# Altium project VENTUNOQ.PrjPcb (part 4 of 18)

## Sheet MODULE_SAIL.SchDoc: MODULE SAIL
size A3; Author: Silvio Navaretti; CompanyName: ARDUINO; DrawnBy: Silvio Navaretti; Engineer: Silvio Navaretti; Organization: ARDUINO; SheetNumber: 4; SheetTotal: 51; RevAuthor: Silvio Navaretti
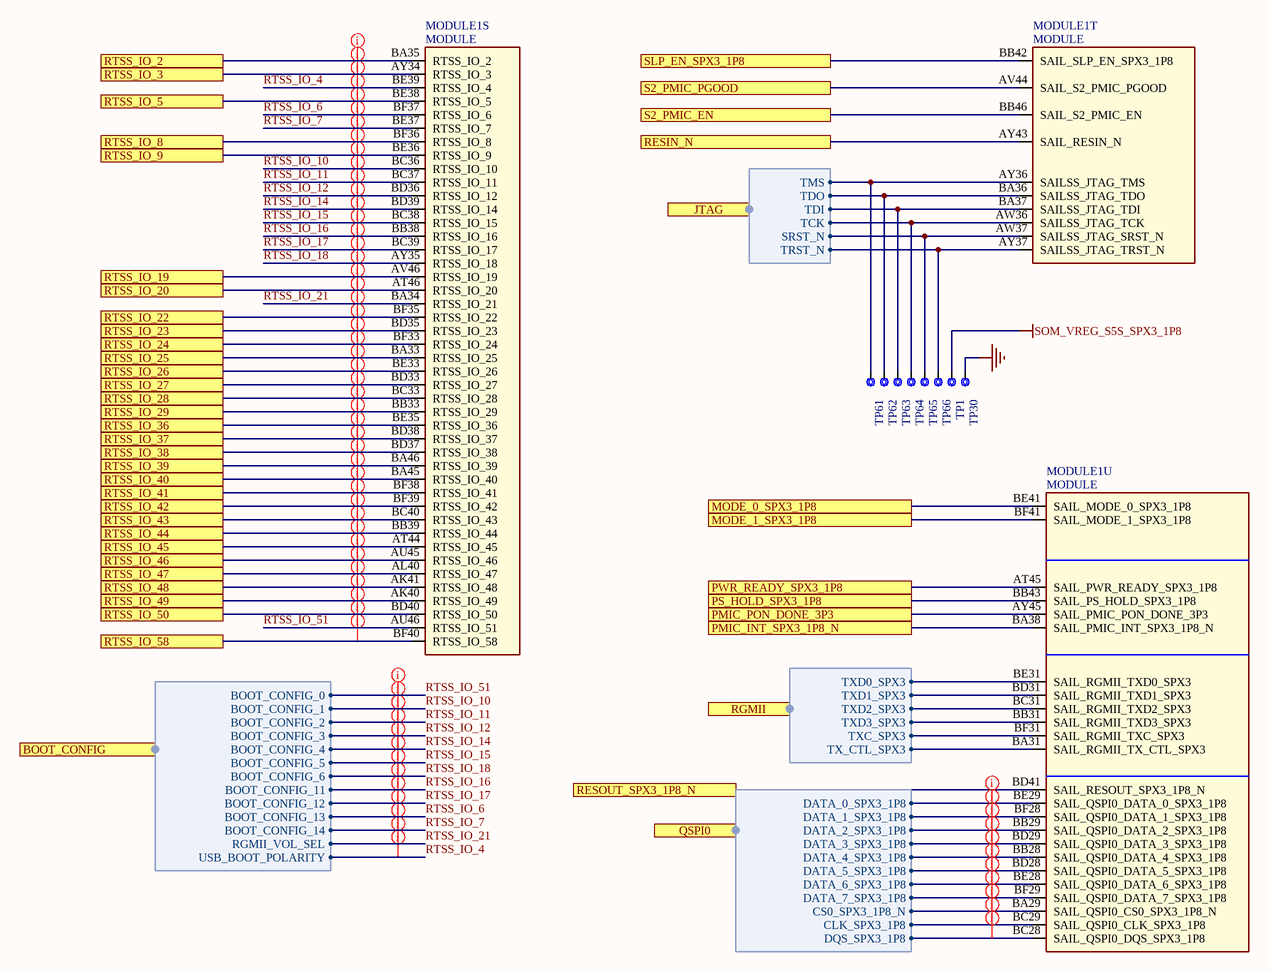
[diagram p5: MODULE_SAIL.SchDoc]

### Parts
MODULE1  MODULE  [MODULE]  (parts S,T,U of 22)
TP1  Test point 1.00mm  [TP-1.00MM]  (value not drawn)  (no BOM)
TP30  Test point 1.00mm  [TP-1.00MM]  (value not drawn)  (no BOM)
TP61  Test point 1.00mm  [TP-1.00MM]  (value not drawn)  (no BOM)
TP62  Test point 1.00mm  [TP-1.00MM]  (value not drawn)  (no BOM)
TP63  Test point 1.00mm  [TP-1.00MM]  (value not drawn)  (no BOM)
TP64  Test point 1.00mm  [TP-1.00MM]  (value not drawn)  (no BOM)
TP65  Test point 1.00mm  [TP-1.00MM]  (value not drawn)  (no BOM)
TP66  Test point 1.00mm  [TP-1.00MM]  (value not drawn)  (no BOM)

### Ports
BOOT_CONFIG (harness SOM_SAIL_BOOT_CONFIG), JTAG (harness SOM_SAIL_JTAG), MODE_0_SPX3_1P8, MODE_1_SPX3_1P8, PMIC_INT_SPX3_1P8_N, PMIC_PON_DONE_3P3, PS_HOLD_SPX3_1P8, PWR_READY_SPX3_1P8, QSPI0 (harness SOM_SAIL_QSPI0), RESIN_N, RESOUT_SPX3_1P8_N, RGMII (harness SOM_SAIL_RGMII), RTSS_IO_2, RTSS_IO_3, RTSS_IO_5, RTSS_IO_8, RTSS_IO_9, RTSS_IO_19, RTSS_IO_20, RTSS_IO_22, RTSS_IO_23, RTSS_IO_24, RTSS_IO_25, RTSS_IO_26, RTSS_IO_27, RTSS_IO_28, RTSS_IO_29, RTSS_IO_36, RTSS_IO_37, RTSS_IO_38, RTSS_IO_39, RTSS_IO_40, RTSS_IO_41, RTSS_IO_42, RTSS_IO_43, RTSS_IO_44, RTSS_IO_45, RTSS_IO_46, RTSS_IO_47, RTSS_IO_48, RTSS_IO_49, RTSS_IO_50, RTSS_IO_58, S2_PMIC_EN, S2_PMIC_PGOOD, SLP_EN_SPX3_1P8

### Harnesses
SOM_SAIL_JTAG: TMS, TDO, TDI, TCK, SRST_N, TRST_N
SOM_SAIL_RGMII: TXD0_SPX3, TXD1_SPX3, TXD2_SPX3, TXD3_SPX3, TXC_SPX3, TX_CTL_SPX3
SOM_SAIL_QSPI0: DATA_0_SPX3_1P8, DATA_1_SPX3_1P8, DATA_2_SPX3_1P8, DATA_3_SPX3_1P8, DATA_4_SPX3_1P8, DATA_5_SPX3_1P8, DATA_6_SPX3_1P8, DATA_7_SPX3_1P8, CS0_SPX3_1P8_N, CLK_SPX3_1P8, DQS_SPX3_1P8
SOM_SAIL_BOOT_CONFIG: BOOT_CONFIG_0, BOOT_CONFIG_1, BOOT_CONFIG_2, BOOT_CONFIG_3, BOOT_CONFIG_4, BOOT_CONFIG_5, BOOT_CONFIG_6, BOOT_CONFIG_11, BOOT_CONFIG_12, BOOT_CONFIG_13, BOOT_CONFIG_14, RGMII_VOL_SEL, USB_BOOT_POLARITY

### Nets
GND: TP30.X
SOM_VREG_S5S_SPX3_1P8: TP1.X
RTSS_IO_4: MODULE1.BE39(RTSS_IO_4) ; port BOOT_CONFIG.USB_BOOT_POLARITY
RTSS_IO_6: MODULE1.BF37(RTSS_IO_6) ; port BOOT_CONFIG.BOOT_CONFIG_13
RTSS_IO_7: MODULE1.BE37(RTSS_IO_7) ; port BOOT_CONFIG.BOOT_CONFIG_14
RTSS_IO_10: MODULE1.BC36(RTSS_IO_10) ; port BOOT_CONFIG.BOOT_CONFIG_1
RTSS_IO_11: MODULE1.BC37(RTSS_IO_11) ; port BOOT_CONFIG.BOOT_CONFIG_2
RTSS_IO_12: MODULE1.BD36(RTSS_IO_12) ; port BOOT_CONFIG.BOOT_CONFIG_3
RTSS_IO_14: MODULE1.BD39(RTSS_IO_14) ; port BOOT_CONFIG.BOOT_CONFIG_4
RTSS_IO_15: MODULE1.BC38(RTSS_IO_15) ; port BOOT_CONFIG.BOOT_CONFIG_5
RTSS_IO_16: MODULE1.BB38(RTSS_IO_16) ; port BOOT_CONFIG.BOOT_CONFIG_11
RTSS_IO_17: MODULE1.BC39(RTSS_IO_17) ; port BOOT_CONFIG.BOOT_CONFIG_12
RTSS_IO_18: MODULE1.AY35(RTSS_IO_18) ; port BOOT_CONFIG.BOOT_CONFIG_6
RTSS_IO_21: MODULE1.BA34(RTSS_IO_21) ; port BOOT_CONFIG.RGMII_VOL_SEL
RTSS_IO_51: MODULE1.AU46(RTSS_IO_51) ; port BOOT_CONFIG.BOOT_CONFIG_0
RTSS_IO_58_FORCE_USB_BOOT_SPX3_1P8: MODULE1.BF40(RTSS_IO_58) ; port RTSS_IO_58
RTSS_RESIN_N: MODULE1.AY43(SAIL_RESIN_N) ; port RESIN_N
SAIL_JTAG.SRST_N: MODULE1.AW37(SAILSS_JTAG_SRST_N) TP65.X ; port JTAG.SRST_N
SAIL_JTAG.TCK: MODULE1.AW36(SAILSS_JTAG_TCK) TP64.X ; port JTAG.TCK
SAIL_JTAG.TDI: MODULE1.BA37(SAILSS_JTAG_TDI) TP63.X ; port JTAG.TDI
SAIL_JTAG.TDO: MODULE1.BA36(SAILSS_JTAG_TDO) TP62.X ; port JTAG.TDO
SAIL_JTAG.TMS: MODULE1.AY36(SAILSS_JTAG_TMS) TP61.X ; port JTAG.TMS
SAIL_JTAG.TRST_N: MODULE1.AY37(SAILSS_JTAG_TRST_N) TP66.X ; port JTAG.TRST_N
NetMODULE1_AK40: MODULE1.AK40(RTSS_IO_49) ; port RTSS_IO_49
NetMODULE1_AK41: MODULE1.AK41(RTSS_IO_48) ; port RTSS_IO_48
NetMODULE1_AL40: MODULE1.AL40(RTSS_IO_47) ; port RTSS_IO_47
NetMODULE1_AT44: MODULE1.AT44(RTSS_IO_45) ; port RTSS_IO_45
NetMODULE1_AT45: MODULE1.AT45(SAIL_PWR_READY_SPX3_1P8) ; port PWR_READY_SPX3_1P8
NetMODULE1_AT46: MODULE1.AT46(RTSS_IO_20) ; port RTSS_IO_20
NetMODULE1_AU45: MODULE1.AU45(RTSS_IO_46) ; port RTSS_IO_46
NetMODULE1_AV44: MODULE1.AV44(SAIL_S2_PMIC_PGOOD) ; port S2_PMIC_PGOOD
NetMODULE1_AV46: MODULE1.AV46(RTSS_IO_19) ; port RTSS_IO_19
NetMODULE1_AY34: MODULE1.AY34(RTSS_IO_3) ; port RTSS_IO_3
NetMODULE1_AY45: MODULE1.AY45(SAIL_PMIC_PON_DONE_3P3) ; port PMIC_PON_DONE_3P3
NetMODULE1_BA29: MODULE1.BA29(SAIL_QSPI0_CS0_SPX3_1P8_N) ; port QSPI0.CS0_SPX3_1P8_N
NetMODULE1_BA31: MODULE1.BA31(SAIL_RGMII_TX_CTL_SPX3) ; port RGMII.TX_CTL_SPX3
NetMODULE1_BA33: MODULE1.BA33(RTSS_IO_25) ; port RTSS_IO_25
NetMODULE1_BA35: MODULE1.BA35(RTSS_IO_2) ; port RTSS_IO_2
NetMODULE1_BA38: MODULE1.BA38(SAIL_PMIC_INT_SPX3_1P8_N) ; port PMIC_INT_SPX3_1P8_N
NetMODULE1_BA45: MODULE1.BA45(RTSS_IO_40) ; port RTSS_IO_40
NetMODULE1_BA46: MODULE1.BA46(RTSS_IO_39) ; port RTSS_IO_39
NetMODULE1_BB28: MODULE1.BB28(SAIL_QSPI0_DATA_4_SPX3_1P8) ; port QSPI0.DATA_4_SPX3_1P8
NetMODULE1_BB29: MODULE1.BB29(SAIL_QSPI0_DATA_2_SPX3_1P8) ; port QSPI0.DATA_2_SPX3_1P8
NetMODULE1_BB31: MODULE1.BB31(SAIL_RGMII_TXD3_SPX3) ; port RGMII.TXD3_SPX3
NetMODULE1_BB33: MODULE1.BB33(RTSS_IO_29) ; port RTSS_IO_29
NetMODULE1_BB39: MODULE1.BB39(RTSS_IO_44) ; port RTSS_IO_44
NetMODULE1_BB42: MODULE1.BB42(SAIL_SLP_EN_SPX3_1P8) ; port SLP_EN_SPX3_1P8
NetMODULE1_BB43: MODULE1.BB43(SAIL_PS_HOLD_SPX3_1P8) ; port PS_HOLD_SPX3_1P8
NetMODULE1_BB46: MODULE1.BB46(SAIL_S2_PMIC_EN) ; port S2_PMIC_EN
NetMODULE1_BC28: MODULE1.BC28(SAIL_QSPI0_DQS_SPX3_1P8) ; port QSPI0.DQS_SPX3_1P8
NetMODULE1_BC29: MODULE1.BC29(SAIL_QSPI0_CLK_SPX3_1P8) ; port QSPI0.CLK_SPX3_1P8
NetMODULE1_BC31: MODULE1.BC31(SAIL_RGMII_TXD2_SPX3) ; port RGMII.TXD2_SPX3
NetMODULE1_BC33: MODULE1.BC33(RTSS_IO_28) ; port RTSS_IO_28
NetMODULE1_BC40: MODULE1.BC40(RTSS_IO_43) ; port RTSS_IO_43
NetMODULE1_BD28: MODULE1.BD28(SAIL_QSPI0_DATA_5_SPX3_1P8) ; port QSPI0.DATA_5_SPX3_1P8
NetMODULE1_BD29: MODULE1.BD29(SAIL_QSPI0_DATA_3_SPX3_1P8) ; port QSPI0.DATA_3_SPX3_1P8
NetMODULE1_BD31: MODULE1.BD31(SAIL_RGMII_TXD1_SPX3) ; port RGMII.TXD1_SPX3
NetMODULE1_BD33: MODULE1.BD33(RTSS_IO_27) ; port RTSS_IO_27
NetMODULE1_BD35: MODULE1.BD35(RTSS_IO_23) ; port RTSS_IO_23
NetMODULE1_BD37: MODULE1.BD37(RTSS_IO_38) ; port RTSS_IO_38
NetMODULE1_BD38: MODULE1.BD38(RTSS_IO_37) ; port RTSS_IO_37
NetMODULE1_BD40: MODULE1.BD40(RTSS_IO_50) ; port RTSS_IO_50
NetMODULE1_BD41: MODULE1.BD41(SAIL_RESOUT_SPX3_1P8_N) ; port RESOUT_SPX3_1P8_N
NetMODULE1_BE28: MODULE1.BE28(SAIL_QSPI0_DATA_6_SPX3_1P8) ; port QSPI0.DATA_6_SPX3_1P8
NetMODULE1_BE29: MODULE1.BE29(SAIL_QSPI0_DATA_0_SPX3_1P8) ; port QSPI0.DATA_0_SPX3_1P8
NetMODULE1_BE31: MODULE1.BE31(SAIL_RGMII_TXD0_SPX3) ; port RGMII.TXD0_SPX3
NetMODULE1_BE33: MODULE1.BE33(RTSS_IO_26) ; port RTSS_IO_26
NetMODULE1_BE35: MODULE1.BE35(RTSS_IO_36) ; port RTSS_IO_36
NetMODULE1_BE36: MODULE1.BE36(RTSS_IO_9) ; port RTSS_IO_9
NetMODULE1_BE38: MODULE1.BE38(RTSS_IO_5) ; port RTSS_IO_5
NetMODULE1_BE41: MODULE1.BE41(SAIL_MODE_0_SPX3_1P8) ; port MODE_0_SPX3_1P8
NetMODULE1_BF28: MODULE1.BF28(SAIL_QSPI0_DATA_1_SPX3_1P8) ; port QSPI0.DATA_1_SPX3_1P8
NetMODULE1_BF29: MODULE1.BF29(SAIL_QSPI0_DATA_7_SPX3_1P8) ; port QSPI0.DATA_7_SPX3_1P8
NetMODULE1_BF31: MODULE1.BF31(SAIL_RGMII_TXC_SPX3) ; port RGMII.TXC_SPX3
NetMODULE1_BF33: MODULE1.BF33(RTSS_IO_24) ; port RTSS_IO_24
NetMODULE1_BF35: MODULE1.BF35(RTSS_IO_22) ; port RTSS_IO_22
NetMODULE1_BF36: MODULE1.BF36(RTSS_IO_8) ; port RTSS_IO_8
NetMODULE1_BF38: MODULE1.BF38(RTSS_IO_41) ; port RTSS_IO_41
NetMODULE1_BF39: MODULE1.BF39(RTSS_IO_42) ; port RTSS_IO_42
NetMODULE1_BF41: MODULE1.BF41(SAIL_MODE_1_SPX3_1P8) ; port MODE_1_SPX3_1P8

### Layout directives
net class NET_SOM_SAIL_BOOT: RTSS_IO_4, RTSS_IO_6, RTSS_IO_7, RTSS_IO_10, RTSS_IO_11, RTSS_IO_12, RTSS_IO_14, RTSS_IO_15, RTSS_IO_16, RTSS_IO_17, RTSS_IO_18, RTSS_IO_21, RTSS_IO_51
net class NET_SOM_SAIL_IO: NetMODULE1_AK40, NetMODULE1_AK41, NetMODULE1_AL40, NetMODULE1_AT44, NetMODULE1_AT46, NetMODULE1_AU45, NetMODULE1_AV46, NetMODULE1_AY34, NetMODULE1_BA33, NetMODULE1_BA35, NetMODULE1_BA45, NetMODULE1_BA46, NetMODULE1_BB33, NetMODULE1_BB39, NetMODULE1_BC33, NetMODULE1_BC40, NetMODULE1_BD33, NetMODULE1_BD35, NetMODULE1_BD37, NetMODULE1_BD38, NetMODULE1_BD40, NetMODULE1_BE33, NetMODULE1_BE35, NetMODULE1_BE36, NetMODULE1_BE38, NetMODULE1_BF33, NetMODULE1_BF35, NetMODULE1_BF36, NetMODULE1_BF38, NetMODULE1_BF39, RTSS_IO_4, RTSS_IO_6, RTSS_IO_7, RTSS_IO_10, RTSS_IO_11, RTSS_IO_12, RTSS_IO_14, RTSS_IO_15, RTSS_IO_16, RTSS_IO_17, RTSS_IO_18, RTSS_IO_21, RTSS_IO_51, RTSS_IO_58_FORCE_USB_BOOT_SPX3_1P8
net class NET_SOM_SAIL_QSPI0: NetMODULE1_BA29, NetMODULE1_BB28, NetMODULE1_BB29, NetMODULE1_BC28, NetMODULE1_BC29, NetMODULE1_BD28, NetMODULE1_BD29, NetMODULE1_BE28, NetMODULE1_BE29, NetMODULE1_BF28, NetMODULE1_BF29

### Notes on the sheet
- Title:
- ID:
- Date:
- Time:
- Version:
- Sheet
- of
- RevAuthor:
- Reference Designs ARE PROVIDED "AS IS" AND "WITH ALL FAULTS. Arduino SA DISCLAIMS ALL OTHER WARRANTIES, EXPRESS OR IMPLIED, REGARDING PRODUCTS, INCLUDING BUT NOT LIMITED TO, ANY IMPLIED WARRANTIES OF MERCHANTABILITY OR FITNESS FOR A PARTICULAR PURPOSE.
  Arduino SA may make changes to specifications and product descriptions at any time, without notice. The Customer must not rely on the absence or characteristics of any features or instructions marked "reserved" or "undefined".
  Arduino SA reserves these for future definition and shall have no responsibility whatsoever for conflicts or incompatibilities arising from future changes to them. The product information on the Web Site or Materials is subject to change without notice.
  Do not finalize a design with this info. ARDUINO and other Arduino brands and logos and Trademarks of Arduino SA. All Arduino SA Trademarks cannot be used without owner's formal permission.
- File:
- Author:

### Library data of the parts
MODULE1 = M0029-A.19: MODULE BGA 1883 balls 57.5x57.5mm; Manufacturer: Qualcomm; Code Arduino: M0029; Part Number: MODULE BGA; Pin Count: 1883
TP1 TP30 TP61-TP66 = UT0013-A.6: Part Number: This is not a component; Design Item ID: CMP-018-0005-A.3; Source: ut.SchLib; Manufacturer: This is not a component; Code Arduino: This is not a component; Pin Count: 1

## Sheet MODULE_MD.SchDoc: MODULE MAIN DOMAIN
size A3; Author: Silvio Navaretti; CompanyName: ARDUINO; DrawnBy: Silvio Navaretti; Engineer: Silvio Navaretti; Organization: ARDUINO; SheetNumber: 3; SheetTotal: 51; RevAuthor: Silvio Navaretti
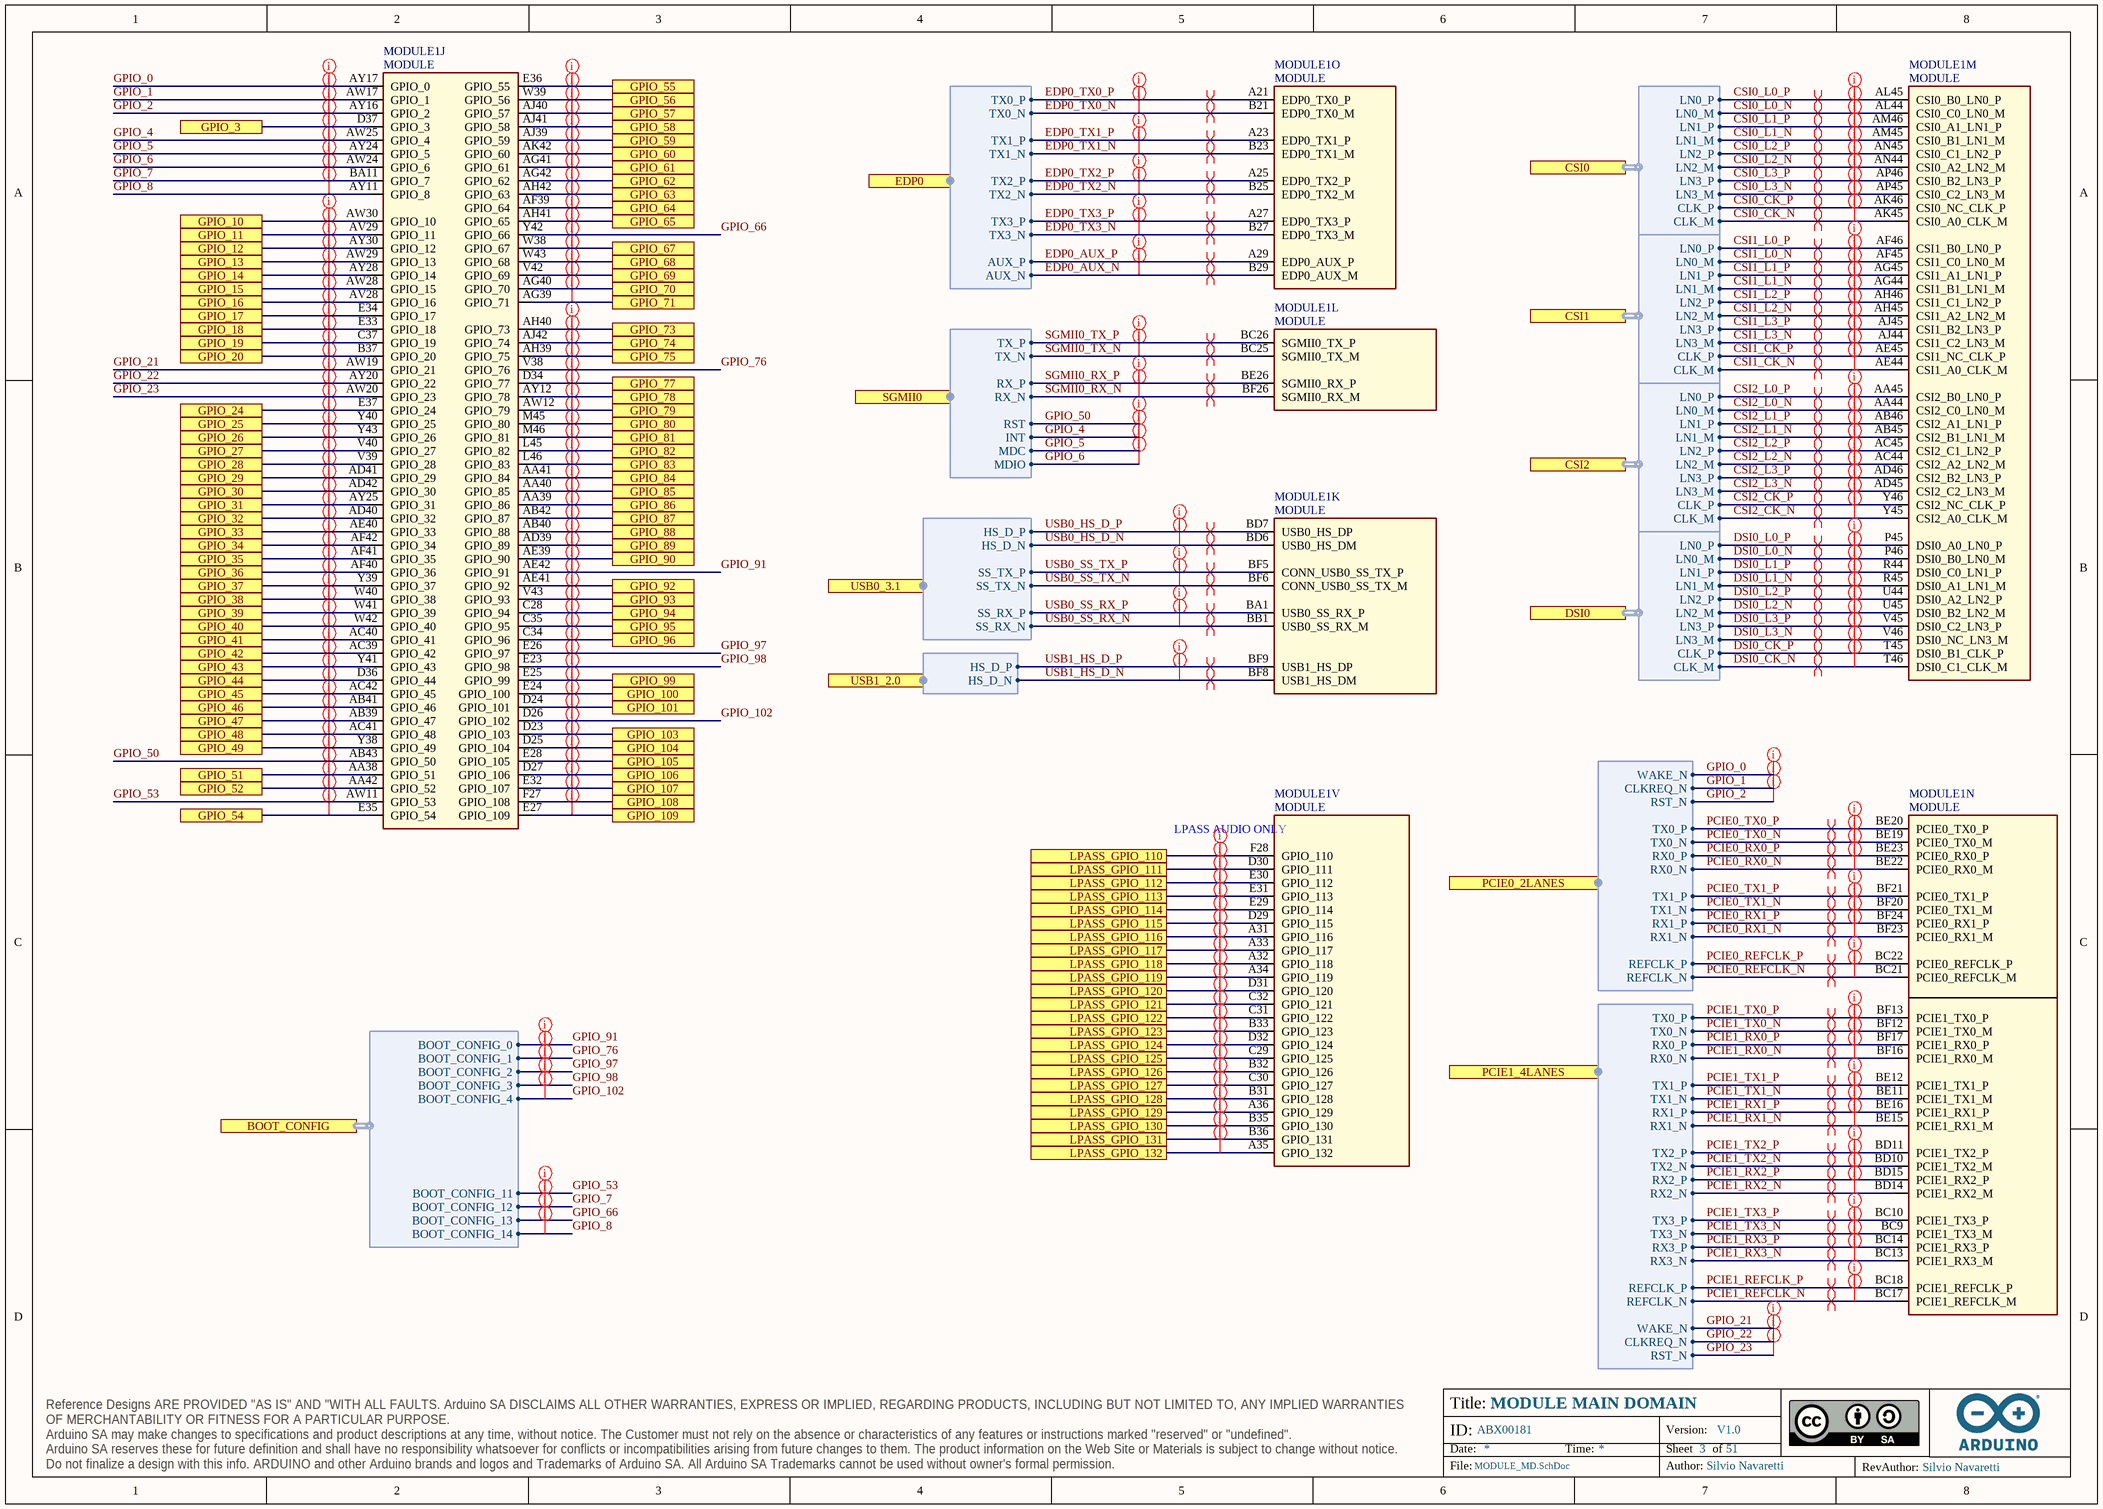
[diagram p6: MODULE_MD.SchDoc]

### Parts
MODULE1  MODULE  [MODULE]  (parts J,K,L,M,N,O,V of 22)

### Ports
BOOT_CONFIG (harness SOM_MD_BOOT_CONFIG), CSI0 (harness MIPI_4LANES), CSI1 (harness MIPI_4LANES), CSI2 (harness MIPI_4LANES), DSI0 (harness MIPI_4LANES), EDP0 (harness SOM_MD_EDP0), GPIO_3, GPIO_10, GPIO_11, GPIO_12, GPIO_13, GPIO_14, GPIO_15, GPIO_16, GPIO_17, GPIO_18, GPIO_19, GPIO_20, GPIO_24, GPIO_25, GPIO_26, GPIO_27, GPIO_28, GPIO_29, GPIO_30, GPIO_31, GPIO_32, GPIO_33, GPIO_34, GPIO_35, GPIO_36, GPIO_37, GPIO_38, GPIO_39, GPIO_40, GPIO_41, GPIO_42, GPIO_43, GPIO_44, GPIO_45, GPIO_46, GPIO_47, GPIO_48, GPIO_49, GPIO_51, GPIO_52, GPIO_54, GPIO_55, GPIO_56, GPIO_57, GPIO_58, GPIO_59, GPIO_60, GPIO_61, GPIO_62, GPIO_63, GPIO_64, GPIO_65, GPIO_67, GPIO_68, GPIO_69, GPIO_70, GPIO_71, GPIO_73, GPIO_74, GPIO_75, GPIO_77, GPIO_78, GPIO_79, GPIO_80, GPIO_81, GPIO_82, GPIO_83, GPIO_84, GPIO_85, GPIO_86, GPIO_87, GPIO_88, GPIO_89, GPIO_90, GPIO_92, GPIO_93, GPIO_94, GPIO_95, GPIO_96, GPIO_99, GPIO_100, GPIO_101, GPIO_103, GPIO_104, GPIO_105, GPIO_106, GPIO_107, GPIO_108, GPIO_109, LPASS_GPIO_110, LPASS_GPIO_111, LPASS_GPIO_112, LPASS_GPIO_113, LPASS_GPIO_114, LPASS_GPIO_115, LPASS_GPIO_116, LPASS_GPIO_117, LPASS_GPIO_118, LPASS_GPIO_119, LPASS_GPIO_120, LPASS_GPIO_121, LPASS_GPIO_122, LPASS_GPIO_123, LPASS_GPIO_124, LPASS_GPIO_125, LPASS_GPIO_126, LPASS_GPIO_127, LPASS_GPIO_128, LPASS_GPIO_129, LPASS_GPIO_130, LPASS_GPIO_131, LPASS_GPIO_132, PCIE0_2LANES (harness SOM_MD_PCIE0), PCIE1_4LANES (harness SOM_MD_PCIE1), SGMII0 (harness SOM_MD_SGMII0), USB0_3.1 (harness SOM_MD_USB0), USB1_2.0 (harness SOM_MD_USB1)

### Harnesses
MIPI_4LANES: LN3_M, LN2_M, LN2_P, LN0_M, LN0_P, CLK_M, CLK_P, LN1_M, LN1_P, LN3_P
SOM_MD_SGMII0: RX_P, RX_N, TX_P, TX_N, RST, MDC, INT, MDIO
SOM_MD_EDP0: TX0_P, TX1_P, TX2_P, TX3_P, AUX_P, TX0_N, TX1_N, TX2_N, TX3_N, AUX_N
SOM_MD_USB0: SS_TX_N, SS_TX_P, HS_D_P, HS_D_N, SS_RX_P, SS_RX_N
SOM_MD_USB1: HS_D_P, HS_D_N
SOM_MD_PCIE0: RX0_N, RX0_P, TX0_P, TX0_N, RX1_N, RX1_P, TX1_P, TX1_N, REFCLK_N, REFCLK_P, WAKE_N, CLKREQ_N, RST_N
SOM_MD_PCIE1: RX0_N, RX0_P, TX0_P, TX0_N, RX1_N, RX1_P, TX1_P, TX1_N, REFCLK_N, REFCLK_P, RX2_N, RX2_P, TX2_P, TX2_N, RX3_N, RX3_P, TX3_P, TX3_N, WAKE_N, CLKREQ_N, RST_N
SOM_MD_BOOT_CONFIG: BOOT_CONFIG_0, BOOT_CONFIG_1, BOOT_CONFIG_2, BOOT_CONFIG_3, BOOT_CONFIG_4, BOOT_CONFIG_11, BOOT_CONFIG_12, BOOT_CONFIG_13, BOOT_CONFIG_14

### Nets
CSI0_CK_N: MODULE1.AK45(CSI0_A0_CLK_M) ; port CSI0.CLK_M
CSI0_CK_P: MODULE1.AK46(CSI0_NC_CLK_P) ; port CSI0.CLK_P
CSI0_L0_N: MODULE1.AL44(CSI0_C0_LN0_M) ; port CSI0.LN0_M
CSI0_L0_P: MODULE1.AL45(CSI0_B0_LN0_P) ; port CSI0.LN0_P
CSI0_L1_N: MODULE1.AM45(CSI0_B1_LN1_M) ; port CSI0.LN1_M
CSI0_L1_P: MODULE1.AM46(CSI0_A1_LN1_P) ; port CSI0.LN1_P
CSI0_L2_N: MODULE1.AN44(CSI0_A2_LN2_M) ; port CSI0.LN2_M
CSI0_L2_P: MODULE1.AN45(CSI0_C1_LN2_P) ; port CSI0.LN2_P
CSI0_L3_N: MODULE1.AP45(CSI0_C2_LN3_M) ; port CSI0.LN3_M
CSI0_L3_P: MODULE1.AP46(CSI0_B2_LN3_P) ; port CSI0.LN3_P
CSI1_CK_N: MODULE1.AE44(CSI1_A0_CLK_M) ; port CSI1.CLK_M
CSI1_CK_P: MODULE1.AE45(CSI1_NC_CLK_P) ; port CSI1.CLK_P
CSI1_L0_N: MODULE1.AF45(CSI1_C0_LN0_M) ; port CSI1.LN0_M
CSI1_L0_P: MODULE1.AF46(CSI1_B0_LN0_P) ; port CSI1.LN0_P
CSI1_L1_N: MODULE1.AG44(CSI1_B1_LN1_M) ; port CSI1.LN1_M
CSI1_L1_P: MODULE1.AG45(CSI1_A1_LN1_P) ; port CSI1.LN1_P
CSI1_L2_N: MODULE1.AH45(CSI1_A2_LN2_M) ; port CSI1.LN2_M
CSI1_L2_P: MODULE1.AH46(CSI1_C1_LN2_P) ; port CSI1.LN2_P
CSI1_L3_N: MODULE1.AJ44(CSI1_C2_LN3_M) ; port CSI1.LN3_M
CSI1_L3_P: MODULE1.AJ45(CSI1_B2_LN3_P) ; port CSI1.LN3_P
CSI2_CK_N: MODULE1.Y45(CSI2_A0_CLK_M) ; port CSI2.CLK_M
CSI2_CK_P: MODULE1.Y46(CSI2_NC_CLK_P) ; port CSI2.CLK_P
CSI2_L0_N: MODULE1.AA44(CSI2_C0_LN0_M) ; port CSI2.LN0_M
CSI2_L0_P: MODULE1.AA45(CSI2_B0_LN0_P) ; port CSI2.LN0_P
CSI2_L1_N: MODULE1.AB45(CSI2_B1_LN1_M) ; port CSI2.LN1_M
CSI2_L1_P: MODULE1.AB46(CSI2_A1_LN1_P) ; port CSI2.LN1_P
CSI2_L2_N: MODULE1.AC44(CSI2_A2_LN2_M) ; port CSI2.LN2_M
CSI2_L2_P: MODULE1.AC45(CSI2_C1_LN2_P) ; port CSI2.LN2_P
CSI2_L3_N: MODULE1.AD45(CSI2_C2_LN3_M) ; port CSI2.LN3_M
CSI2_L3_P: MODULE1.AD46(CSI2_B2_LN3_P) ; port CSI2.LN3_P
CTS_1V8: MODULE1.AA41(GPIO_84) ; port GPIO_84
DSI0_CK_N: MODULE1.T46(DSI0_C1_CLK_M) ; port DSI0.CLK_M
DSI0_CK_P: MODULE1.T45(DSI0_B1_CLK_P) ; port DSI0.CLK_P
DSI0_L0_N: MODULE1.P46(DSI0_B0_LN0_M) ; port DSI0.LN0_M
DSI0_L0_P: MODULE1.P45(DSI0_A0_LN0_P) ; port DSI0.LN0_P
DSI0_L1_N: MODULE1.R45(DSI0_A1_LN1_M) ; port DSI0.LN1_M
DSI0_L1_P: MODULE1.R44(DSI0_C0_LN1_P) ; port DSI0.LN1_P
DSI0_L2_N: MODULE1.U45(DSI0_B2_LN2_M) ; port DSI0.LN2_M
DSI0_L2_P: MODULE1.U44(DSI0_A2_LN2_P) ; port DSI0.LN2_P
DSI0_L3_N: MODULE1.V46(DSI0_NC_LN3_M) ; port DSI0.LN3_M
DSI0_L3_P: MODULE1.V45(DSI0_C2_LN3_P) ; port DSI0.LN3_P
EDP0_AUX_N: MODULE1.B29(EDP0_AUX_M) ; port EDP0.AUX_N
EDP0_AUX_P: MODULE1.A29(EDP0_AUX_P) ; port EDP0.AUX_P
EDP0_TX0_N: MODULE1.B21(EDP0_TX0_M) ; port EDP0.TX0_N
EDP0_TX0_P: MODULE1.A21(EDP0_TX0_P) ; port EDP0.TX0_P
EDP0_TX1_N: MODULE1.B23(EDP0_TX1_M) ; port EDP0.TX1_N
EDP0_TX1_P: MODULE1.A23(EDP0_TX1_P) ; port EDP0.TX1_P
EDP0_TX2_N: MODULE1.B25(EDP0_TX2_M) ; port EDP0.TX2_N
EDP0_TX2_P: MODULE1.A25(EDP0_TX2_P) ; port EDP0.TX2_P
EDP0_TX3_N: MODULE1.B27(EDP0_TX3_M) ; port EDP0.TX3_N
EDP0_TX3_P: MODULE1.A27(EDP0_TX3_P) ; port EDP0.TX3_P
GPIO_0: MODULE1.AY17(GPIO_0) ; port PCIE0_2LANES.WAKE_N
GPIO_1: MODULE1.AW17(GPIO_1) ; port PCIE0_2LANES.CLKREQ_N  [project net CLKREQ_N_1V8]
GPIO_2: MODULE1.AY16(GPIO_2) ; port PCIE0_2LANES.RST_N
GPIO_4: MODULE1.AW25(GPIO_4) ; port SGMII0.INT
GPIO_5: MODULE1.AY24(GPIO_5) ; port SGMII0.MDC
GPIO_6: MODULE1.AW24(GPIO_6) ; port SGMII0.MDIO
GPIO_7: MODULE1.BA11(GPIO_7) ; port BOOT_CONFIG.BOOT_CONFIG_12
GPIO_8: MODULE1.AY11(GPIO_8) ; port BOOT_CONFIG.BOOT_CONFIG_14
GPIO_21: MODULE1.AW19(GPIO_21) ; port PCIE1_4LANES.WAKE_N
GPIO_22: MODULE1.AY20(GPIO_22) ; port PCIE1_4LANES.CLKREQ_N
GPIO_23: MODULE1.AW20(GPIO_23) ; port PCIE1_4LANES.RST_N
GPIO_50: MODULE1.AB43(GPIO_50) ; port SGMII0.RST
GPIO_53: MODULE1.AW11(GPIO_53) ; port BOOT_CONFIG.BOOT_CONFIG_11
GPIO_66: MODULE1.Y42(GPIO_66) ; port BOOT_CONFIG.BOOT_CONFIG_13
GPIO_76: MODULE1.V38(GPIO_76) ; port BOOT_CONFIG.BOOT_CONFIG_1
GPIO_91: MODULE1.AE42(GPIO_91) ; port BOOT_CONFIG.BOOT_CONFIG_0
GPIO_97: MODULE1.E26(GPIO_97) ; port BOOT_CONFIG.BOOT_CONFIG_2
GPIO_98: MODULE1.E23(GPIO_98) ; port BOOT_CONFIG.BOOT_CONFIG_3
GPIO_102: MODULE1.D26(GPIO_102) ; port BOOT_CONFIG.BOOT_CONFIG_4
I2S_DATA0: MODULE1.A32(GPIO_118) ; port LPASS_GPIO_118
I2S_DATA1: MODULE1.A34(GPIO_119) ; port LPASS_GPIO_119
I2S_SCK: MODULE1.A31(GPIO_116) ; port LPASS_GPIO_116
I2S_WS: MODULE1.A33(GPIO_117) ; port LPASS_GPIO_117
MD_CCI_I2C0.SCL: MODULE1.AJ41(GPIO_58) ; port GPIO_58
MD_CCI_I2C0.SDA: MODULE1.AJ40(GPIO_57) ; port GPIO_57
MD_CCI_I2C2.SCL: MODULE1.AK42(GPIO_60) ; port GPIO_60
MD_CCI_I2C2.SDA: MODULE1.AJ39(GPIO_59) ; port GPIO_59
MD_CCI_I2C3.SCL: MODULE1.AD40(GPIO_32) ; port GPIO_32
MD_CCI_I2C3.SDA: MODULE1.AY25(GPIO_31) ; port GPIO_31
MD_CCI_I2C4.SCL: MODULE1.AG42(GPIO_62) ; port GPIO_62
MD_CCI_I2C4.SDA: MODULE1.AG41(GPIO_61) ; port GPIO_61
MD_GPIO_3: MODULE1.D37(GPIO_3) ; port GPIO_3
MD_GPIO_10: MODULE1.AW30(GPIO_10) ; port GPIO_10
MD_GPIO_11: MODULE1.AV29(GPIO_11) ; port GPIO_11
MD_GPIO_12: MODULE1.AY30(GPIO_12) ; port GPIO_12
MD_GPIO_13: MODULE1.AW29(GPIO_13) ; port GPIO_13
MD_GPIO_14: MODULE1.AY28(GPIO_14) ; port GPIO_14
MD_GPIO_15: MODULE1.AW28(GPIO_15) ; port GPIO_15
MD_GPIO_16: MODULE1.AV28(GPIO_16) ; port GPIO_16
MD_GPIO_17: MODULE1.E34(GPIO_17) ; port GPIO_17
MD_GPIO_18: MODULE1.E33(GPIO_18) ; port GPIO_18
MD_GPIO_19: MODULE1.C37(GPIO_19) ; port GPIO_19
MD_GPIO_20: MODULE1.B37(GPIO_20) ; port GPIO_20
MD_GPIO_24: MODULE1.E37(GPIO_24) ; port GPIO_24
MD_GPIO_25: MODULE1.Y40(GPIO_25) ; port GPIO_25
MD_GPIO_26: MODULE1.Y43(GPIO_26) ; port GPIO_26
MD_GPIO_27: MODULE1.V40(GPIO_27) ; port GPIO_27
MD_GPIO_28: MODULE1.V39(GPIO_28) ; port GPIO_28
MD_GPIO_29: MODULE1.AD41(GPIO_29) ; port GPIO_29
MD_GPIO_30: MODULE1.AD42(GPIO_30) ; port GPIO_30
MD_GPIO_33: MODULE1.AE40(GPIO_33) ; port GPIO_33
MD_GPIO_34: MODULE1.AF42(GPIO_34) ; port GPIO_34
MD_GPIO_35: MODULE1.AF41(GPIO_35) ; port GPIO_35
MD_GPIO_36: MODULE1.AF40(GPIO_36) ; port GPIO_36
MD_GPIO_37: MODULE1.Y39(GPIO_37) ; port GPIO_37
MD_GPIO_38: MODULE1.W40(GPIO_38) ; port GPIO_38
MD_GPIO_39: MODULE1.W41(GPIO_39) ; port GPIO_39
MD_GPIO_40: MODULE1.W42(GPIO_40) ; port GPIO_40
MD_GPIO_41: MODULE1.AC40(GPIO_41) ; port GPIO_41
MD_GPIO_42: MODULE1.AC39(GPIO_42) ; port GPIO_42
MD_GPIO_43: MODULE1.Y41(GPIO_43) ; port GPIO_43
MD_GPIO_44: MODULE1.D36(GPIO_44) ; port GPIO_44
MD_GPIO_45: MODULE1.AC42(GPIO_45) ; port GPIO_45
MD_GPIO_46: MODULE1.AB41(GPIO_46) ; port GPIO_46
MD_GPIO_47: MODULE1.AB39(GPIO_47) ; port GPIO_47
MD_GPIO_48: MODULE1.AC41(GPIO_48) ; port GPIO_48
MD_GPIO_49: MODULE1.Y38(GPIO_49) ; port GPIO_49
MD_GPIO_51: MODULE1.AA38(GPIO_51) ; port GPIO_51
MD_GPIO_52: MODULE1.AA42(GPIO_52) ; port GPIO_52
MD_GPIO_54: MODULE1.E35(GPIO_54) ; port GPIO_54
MD_GPIO_55: MODULE1.E36(GPIO_55) ; port GPIO_55
MD_GPIO_56: MODULE1.W39(GPIO_56) ; port GPIO_56
MD_GPIO_63: MODULE1.AH42(GPIO_63) ; port GPIO_63
MD_GPIO_64: MODULE1.AF39(GPIO_64) ; port GPIO_64
MD_GPIO_65: MODULE1.AH41(GPIO_65) ; port GPIO_65
MD_GPIO_67: MODULE1.W38(GPIO_67) ; port GPIO_67
MD_GPIO_68: MODULE1.W43(GPIO_68) ; port GPIO_68
MD_GPIO_69: MODULE1.V42(GPIO_69) ; port GPIO_69
MD_GPIO_70: MODULE1.AG40(GPIO_70) ; port GPIO_70
MD_GPIO_71: MODULE1.AG39(GPIO_71) ; port GPIO_71
MD_GPIO_73: MODULE1.AH40(GPIO_73) ; port GPIO_73
MD_GPIO_74: MODULE1.AJ42(GPIO_74) ; port GPIO_74
MD_GPIO_75: MODULE1.AH39(GPIO_75) ; port GPIO_75
MD_GPIO_77: MODULE1.D34(GPIO_77) ; port GPIO_77
MD_GPIO_78: MODULE1.AY12(GPIO_78) ; port GPIO_78
MD_GPIO_79: MODULE1.AW12(GPIO_79) ; port GPIO_79
MD_GPIO_80: MODULE1.M45(GPIO_80) ; port GPIO_80
MD_GPIO_81: MODULE1.M46(GPIO_81) ; port GPIO_81
MD_GPIO_82: MODULE1.L45(GPIO_82) ; port GPIO_82
MD_GPIO_83: MODULE1.L46(GPIO_83) ; port GPIO_83
MD_GPIO_85: MODULE1.AA40(GPIO_85) ; port GPIO_85
MD_GPIO_86: MODULE1.AA39(GPIO_86) ; port GPIO_86
MD_GPIO_87: MODULE1.AB42(GPIO_87) ; port GPIO_87
MD_GPIO_88: MODULE1.AB40(GPIO_88) ; port GPIO_88
MD_GPIO_89: MODULE1.AD39(GPIO_89) ; port GPIO_89
MD_GPIO_90: MODULE1.AE39(GPIO_90) ; port GPIO_90
MD_GPIO_92: MODULE1.AE41(GPIO_92) ; port GPIO_92
MD_GPIO_93: MODULE1.V43(GPIO_93) ; port GPIO_93
MD_GPIO_94: MODULE1.C28(GPIO_94) ; port GPIO_94
MD_GPIO_95: MODULE1.C35(GPIO_95) ; port GPIO_95
MD_GPIO_96: MODULE1.C34(GPIO_96) ; port GPIO_96
MD_GPIO_99: MODULE1.E25(GPIO_99) ; port GPIO_99
MD_GPIO_100: MODULE1.E24(GPIO_100) ; port GPIO_100
MD_GPIO_101: MODULE1.D24(GPIO_101) ; port GPIO_101
MD_GPIO_103: MODULE1.D23(GPIO_103) ; port GPIO_103
MD_GPIO_104: MODULE1.D25(GPIO_104) ; port GPIO_104
MD_GPIO_105: MODULE1.E28(GPIO_105) ; port GPIO_105
MD_GPIO_106: MODULE1.D27(GPIO_106) ; port GPIO_106
MD_GPIO_107: MODULE1.E32(GPIO_107) ; port GPIO_107
MD_GPIO_108: MODULE1.F27(GPIO_108) ; port GPIO_108
MD_GPIO_109: MODULE1.E27(GPIO_109) ; port GPIO_109
MD_LPASS_GPIO_110: MODULE1.F28(GPIO_110) ; port LPASS_GPIO_110
MD_LPASS_GPIO_111: MODULE1.D30(GPIO_111) ; port LPASS_GPIO_111
MD_LPASS_GPIO_112: MODULE1.E30(GPIO_112) ; port LPASS_GPIO_112
MD_LPASS_GPIO_113: MODULE1.E31(GPIO_113) ; port LPASS_GPIO_113
MD_LPASS_GPIO_115: MODULE1.D29(GPIO_115) ; port LPASS_GPIO_115
MD_LPASS_GPIO_120: MODULE1.D31(GPIO_120) ; port LPASS_GPIO_120
MD_LPASS_GPIO_121: MODULE1.C32(GPIO_121) ; port LPASS_GPIO_121
MD_LPASS_GPIO_122: MODULE1.C31(GPIO_122) ; port LPASS_GPIO_122
MD_LPASS_GPIO_123: MODULE1.B33(GPIO_123) ; port LPASS_GPIO_123
MD_LPASS_GPIO_125: MODULE1.C29(GPIO_125) ; port LPASS_GPIO_125
MD_LPASS_GPIO_126: MODULE1.B32(GPIO_126) ; port LPASS_GPIO_126
MD_LPASS_GPIO_127: MODULE1.C30(GPIO_127) ; port LPASS_GPIO_127
MD_LPASS_GPIO_129: MODULE1.A36(GPIO_129) ; port LPASS_GPIO_129
MD_LPASS_GPIO_130: MODULE1.B35(GPIO_130) ; port LPASS_GPIO_130
MD_LPASS_GPIO_131: MODULE1.B36(GPIO_131) ; port LPASS_GPIO_131
MD_LPASS_GPIO_132: MODULE1.A35(GPIO_132) ; port LPASS_GPIO_132
PCIE0_REFCLK_N: MODULE1.BC21(PCIE0_REFCLK_M) ; port PCIE0_2LANES.REFCLK_N  [project net MD_PCIE0_2LANES.REFCLK_N]
PCIE0_REFCLK_P: MODULE1.BC22(PCIE0_REFCLK_P) ; port PCIE0_2LANES.REFCLK_P  [project net MD_PCIE0_2LANES.REFCLK_P]
PCIE0_RX0_N: MODULE1.BE22(PCIE0_RX0_M) ; port PCIE0_2LANES.RX0_N  [project net MD_PCIE0_2LANES.RX0_N]
PCIE0_RX0_P: MODULE1.BE23(PCIE0_RX0_P) ; port PCIE0_2LANES.RX0_P  [project net MD_PCIE0_2LANES.RX0_P]
PCIE0_RX1_N: MODULE1.BF23(PCIE0_RX1_M) ; port PCIE0_2LANES.RX1_N  [project net MD_PCIE0_2LANES.RX1_N]
PCIE0_RX1_P: MODULE1.BF24(PCIE0_RX1_P) ; port PCIE0_2LANES.RX1_P  [project net MD_PCIE0_2LANES.RX1_P]
PCIE0_TX0_N: MODULE1.BE19(PCIE0_TX0_M) ; port PCIE0_2LANES.TX0_N  [project net MD_PCIE0_2LANES.TX0_N]
PCIE0_TX0_P: MODULE1.BE20(PCIE0_TX0_P) ; port PCIE0_2LANES.TX0_P  [project net MD_PCIE0_2LANES.TX0_P]
PCIE0_TX1_N: MODULE1.BF20(PCIE0_TX1_M) ; port PCIE0_2LANES.TX1_N  [project net MD_PCIE0_2LANES.TX1_N]
PCIE0_TX1_P: MODULE1.BF21(PCIE0_TX1_P) ; port PCIE0_2LANES.TX1_P  [project net MD_PCIE0_2LANES.TX1_P]
PCIE1_REFCLK_N: MODULE1.BC17(PCIE1_REFCLK_M) ; port PCIE1_4LANES.REFCLK_N  [project net MD_PCIE1_4LANES.REFCLK_N]
PCIE1_REFCLK_P: MODULE1.BC18(PCIE1_REFCLK_P) ; port PCIE1_4LANES.REFCLK_P  [project net MD_PCIE1_4LANES.REFCLK_P]
PCIE1_RX0_N: MODULE1.BF16(PCIE1_RX0_M) ; port PCIE1_4LANES.RX0_N  [project net MD_PCIE1_4LANES.RX0_N]
PCIE1_RX0_P: MODULE1.BF17(PCIE1_RX0_P) ; port PCIE1_4LANES.RX0_P  [project net MD_PCIE1_4LANES.RX0_P]
PCIE1_RX1_N: MODULE1.BE15(PCIE1_RX1_M) ; port PCIE1_4LANES.RX1_N  [project net MD_PCIE1_4LANES.RX1_N]
PCIE1_RX1_P: MODULE1.BE16(PCIE1_RX1_P) ; port PCIE1_4LANES.RX1_P  [project net MD_PCIE1_4LANES.RX1_P]
PCIE1_RX2_N: MODULE1.BD14(PCIE1_RX2_M) ; port PCIE1_4LANES.RX2_N  [project net MD_PCIE1_4LANES.RX2_N]
PCIE1_RX2_P: MODULE1.BD15(PCIE1_RX2_P) ; port PCIE1_4LANES.RX2_P  [project net MD_PCIE1_4LANES.RX2_P]
PCIE1_RX3_N: MODULE1.BC13(PCIE1_RX3_M) ; port PCIE1_4LANES.RX3_N  [project net MD_PCIE1_4LANES.RX3_N]
PCIE1_RX3_P: MODULE1.BC14(PCIE1_RX3_P) ; port PCIE1_4LANES.RX3_P  [project net MD_PCIE1_4LANES.RX3_P]
PCIE1_TX0_N: MODULE1.BF12(PCIE1_TX0_M) ; port PCIE1_4LANES.TX0_N  [project net MD_PCIE1_4LANES.TX0_N]
PCIE1_TX0_P: MODULE1.BF13(PCIE1_TX0_P) ; port PCIE1_4LANES.TX0_P  [project net MD_PCIE1_4LANES.TX0_P]
PCIE1_TX1_N: MODULE1.BE11(PCIE1_TX1_M) ; port PCIE1_4LANES.TX1_N  [project net MD_PCIE1_4LANES.TX1_N]
PCIE1_TX1_P: MODULE1.BE12(PCIE1_TX1_P) ; port PCIE1_4LANES.TX1_P  [project net MD_PCIE1_4LANES.TX1_P]
PCIE1_TX2_N: MODULE1.BD10(PCIE1_TX2_M) ; port PCIE1_4LANES.TX2_N  [project net MD_PCIE1_4LANES.TX2_N]
PCIE1_TX2_P: MODULE1.BD11(PCIE1_TX2_P) ; port PCIE1_4LANES.TX2_P  [project net MD_PCIE1_4LANES.TX2_P]
PCIE1_TX3_N: MODULE1.BC9(PCIE1_TX3_M) ; port PCIE1_4LANES.TX3_N  [project net MD_PCIE1_4LANES.TX3_N]
PCIE1_TX3_P: MODULE1.BC10(PCIE1_TX3_P) ; port PCIE1_4LANES.TX3_P  [project net MD_PCIE1_4LANES.TX3_P]
SGMII0_RX_N: MODULE1.BF26(SGMII0_RX_M) ; port SGMII0.RX_N  [project net MD_SGMII0.RX_N]
SGMII0_RX_P: MODULE1.BE26(SGMII0_RX_P) ; port SGMII0.RX_P  [project net MD_SGMII0.RX_P]
SGMII0_TX_N: MODULE1.BC25(SGMII0_TX_M) ; port SGMII0.TX_N  [project net MD_SGMII0.TX_N]
SGMII0_TX_P: MODULE1.BC26(SGMII0_TX_P) ; port SGMII0.TX_P  [project net MD_SGMII0.TX_P]
USB0_HS_D_N: MODULE1.BD6(USB0_HS_DM) ; port USB0_3.1.HS_D_N  [project net MD_USB0_3.1.HS_D_N]
USB0_HS_D_P: MODULE1.BD7(USB0_HS_DP) ; port USB0_3.1.HS_D_P  [project net MD_USB0_3.1.HS_D_P]
USB0_SS_RX_N: MODULE1.BB1(USB0_SS_RX_M) ; port USB0_3.1.SS_RX_N  [project net MD_USB0_3.1.SS_RX_N]
USB0_SS_RX_P: MODULE1.BA1(USB0_SS_RX_P) ; port USB0_3.1.SS_RX_P  [project net MD_USB0_3.1.SS_RX_P]
USB0_SS_TX_N: MODULE1.BF6(CONN_USB0_SS_TX_M) ; port USB0_3.1.SS_TX_N  [project net MD_USB0_3.1.SS_TX_N]
USB0_SS_TX_P: MODULE1.BF5(CONN_USB0_SS_TX_P) ; port USB0_3.1.SS_TX_P  [project net MD_USB0_3.1.SS_TX_P]
USB1_HS_D_N: MODULE1.BF8(USB1_HS_DM) ; port USB1_2.0.HS_D_N  [project net MD_USB1_2.0.HS_D_N]
USB1_HS_D_P: MODULE1.BF9(USB1_HS_DP) ; port USB1_2.0.HS_D_P  [project net MD_USB1_2.0.HS_D_P]
NetMODULE1_B31: MODULE1.B31(GPIO_128) ; port LPASS_GPIO_128
NetMODULE1_D32: MODULE1.D32(GPIO_124) ; port LPASS_GPIO_124
NetMODULE1_E29: MODULE1.E29(GPIO_114) ; port LPASS_GPIO_114

### Layout directives
differential pair; differential pair class DIFF_MD_CSI0; net class NET_DIFF_CSI_DSI: CSI0_CK_N, CSI0_CK_P, CSI0_L0_N, CSI0_L0_P, CSI0_L1_N, CSI0_L1_P, CSI0_L2_N, CSI0_L2_P, CSI0_L3_N, CSI0_L3_P
differential pair; differential pair class DIFF_MD_CSI1; net class NET_DIFF_CSI_DSI: CSI1_CK_N, CSI1_CK_P, CSI1_L0_N, CSI1_L0_P, CSI1_L1_N, CSI1_L1_P, CSI1_L2_N, CSI1_L2_P, CSI1_L3_N, CSI1_L3_P
differential pair; differential pair class DIFF_MD_CSI2; net class NET_DIFF_CSI_DSI: CSI2_CK_N, CSI2_CK_P, CSI2_L0_N, CSI2_L0_P, CSI2_L1_N, CSI2_L1_P, CSI2_L2_N, CSI2_L2_P, CSI2_L3_N, CSI2_L3_P
differential pair; differential pair class DIFF_MD_DSI0; net class NET_DIFF_CSI_DSI: DSI0_CK_N, DSI0_CK_P, DSI0_L0_N, DSI0_L0_P, DSI0_L1_N, DSI0_L1_P, DSI0_L2_N, DSI0_L2_P, DSI0_L3_N, DSI0_L3_P
differential pair; differential pair class DIFF_MD_EDP; net class NET_DIFF_MD: EDP0_AUX_N, EDP0_AUX_P, EDP0_TX0_N, EDP0_TX0_P, EDP0_TX1_N, EDP0_TX1_P, EDP0_TX2_N, EDP0_TX2_P, EDP0_TX3_N, EDP0_TX3_P
differential pair; differential pair class DIFF_MD_SGMII; net class NET_DIFF_SGMII: MD_SGMII0.RX_N, MD_SGMII0.RX_P, MD_SGMII0.TX_N, MD_SGMII0.TX_P
differential pair; differential pair class DIFF_MD_USB0; net class DIFF_USB: MD_USB0_3.1.HS_D_N, MD_USB0_3.1.HS_D_P, MD_USB0_3.1.SS_RX_N, MD_USB0_3.1.SS_RX_P, MD_USB0_3.1.SS_TX_N, MD_USB0_3.1.SS_TX_P
differential pair; differential pair class DIFF_MD_PCIE0; net class NET_DIFF_PCIE: MD_PCIE0_2LANES.REFCLK_N, MD_PCIE0_2LANES.REFCLK_P, MD_PCIE0_2LANES.RX0_N, MD_PCIE0_2LANES.RX0_P, MD_PCIE0_2LANES.RX1_N, MD_PCIE0_2LANES.RX1_P, MD_PCIE0_2LANES.TX0_N, MD_PCIE0_2LANES.TX0_P, MD_PCIE0_2LANES.TX1_N, MD_PCIE0_2LANES.TX1_P
differential pair; differential pair class DIFF_MD_PCIE1; net class NET_DIFF_PCIE: MD_PCIE1_4LANES.REFCLK_N, MD_PCIE1_4LANES.REFCLK_P, MD_PCIE1_4LANES.RX0_N, MD_PCIE1_4LANES.RX0_P, MD_PCIE1_4LANES.RX1_N, MD_PCIE1_4LANES.RX1_P, MD_PCIE1_4LANES.RX2_N, MD_PCIE1_4LANES.RX2_P, MD_PCIE1_4LANES.RX3_N, MD_PCIE1_4LANES.RX3_P, MD_PCIE1_4LANES.TX0_N, MD_PCIE1_4LANES.TX0_P, MD_PCIE1_4LANES.TX1_N, MD_PCIE1_4LANES.TX1_P, MD_PCIE1_4LANES.TX2_N, MD_PCIE1_4LANES.TX2_P, MD_PCIE1_4LANES.TX3_N, MD_PCIE1_4LANES.TX3_P
net class NET_SOM_MD_SGMII0: GPIO_4, GPIO_5, GPIO_6, GPIO_50, MD_SGMII0.RX_N, MD_SGMII0.RX_P, MD_SGMII0.TX_N, MD_SGMII0.TX_P
net class NET_SOM_MD_USB0: MD_USB0_3.1.HS_D_N, MD_USB0_3.1.HS_D_P, MD_USB0_3.1.SS_RX_N, MD_USB0_3.1.SS_RX_P, MD_USB0_3.1.SS_TX_N, MD_USB0_3.1.SS_TX_P
net class NET_SOM_MD_USB1: MD_USB1_2.0.HS_D_N, MD_USB1_2.0.HS_D_P
differential pair; differential pair class DIFF_MD_USB1; net class DIFF_USB: MD_USB1_2.0.HS_D_N, MD_USB1_2.0.HS_D_P
net class NET_SOM_MD_GPIO: CLKREQ_N_1V8, CTS_1V8, GPIO_0, GPIO_2, GPIO_4, GPIO_5, GPIO_6, GPIO_7, GPIO_8, GPIO_21, GPIO_22, GPIO_23, GPIO_50, GPIO_53, GPIO_66, GPIO_76, GPIO_91, GPIO_97, GPIO_98, GPIO_102, MD_CCI_I2C0.SCL, MD_CCI_I2C0.SDA, MD_CCI_I2C2.SCL, MD_CCI_I2C2.SDA, MD_CCI_I2C3.SCL, MD_CCI_I2C3.SDA, MD_CCI_I2C4.SCL, MD_CCI_I2C4.SDA, MD_GPIO_3, MD_GPIO_10, MD_GPIO_11, MD_GPIO_12, MD_GPIO_13, MD_GPIO_14, MD_GPIO_15, MD_GPIO_16, MD_GPIO_17, MD_GPIO_18, MD_GPIO_19, MD_GPIO_20, MD_GPIO_24, MD_GPIO_25, MD_GPIO_26, MD_GPIO_27, MD_GPIO_28, MD_GPIO_29, MD_GPIO_30, MD_GPIO_33, MD_GPIO_34, MD_GPIO_35, MD_GPIO_36, MD_GPIO_37, MD_GPIO_38, MD_GPIO_39, MD_GPIO_40, MD_GPIO_41, MD_GPIO_42, MD_GPIO_43, MD_GPIO_44, MD_GPIO_45, MD_GPIO_46, MD_GPIO_47, MD_GPIO_48, MD_GPIO_49, MD_GPIO_51, MD_GPIO_52, MD_GPIO_54, MD_GPIO_55, MD_GPIO_56, MD_GPIO_63, MD_GPIO_64, MD_GPIO_65, MD_GPIO_67, MD_GPIO_68, MD_GPIO_69, MD_GPIO_70, MD_GPIO_71, MD_GPIO_73, MD_GPIO_74, MD_GPIO_75, MD_GPIO_77, MD_GPIO_78, MD_GPIO_79, MD_GPIO_80, MD_GPIO_81, MD_GPIO_82, MD_GPIO_83, MD_GPIO_85, MD_GPIO_86, MD_GPIO_87, MD_GPIO_88, MD_GPIO_89, MD_GPIO_90, MD_GPIO_92, MD_GPIO_93, MD_GPIO_94, MD_GPIO_95, MD_GPIO_96, MD_GPIO_99, MD_GPIO_100, MD_GPIO_101, MD_GPIO_103, MD_GPIO_104, MD_GPIO_105, MD_GPIO_106, MD_GPIO_107, MD_GPIO_108, MD_GPIO_109
net class NET_SOM_MD_EDP0: EDP0_AUX_N, EDP0_AUX_P, EDP0_TX0_N, EDP0_TX0_P, EDP0_TX1_N, EDP0_TX1_P, EDP0_TX2_N, EDP0_TX2_P, EDP0_TX3_N, EDP0_TX3_P
net class NET_SOM_MD_CSI0: CSI0_CK_N, CSI0_CK_P, CSI0_L0_N, CSI0_L0_P, CSI0_L1_N, CSI0_L1_P, CSI0_L2_N, CSI0_L2_P, CSI0_L3_N, CSI0_L3_P
net class NET_SOM_MD_CSI1: CSI1_CK_N, CSI1_CK_P, CSI1_L0_N, CSI1_L0_P, CSI1_L1_N, CSI1_L1_P, CSI1_L2_N, CSI1_L2_P, CSI1_L3_N, CSI1_L3_P
net class NET_SOM_MD_CSI2: CSI2_CK_N, CSI2_CK_P, CSI2_L0_N, CSI2_L0_P, CSI2_L1_N, CSI2_L1_P, CSI2_L2_N, CSI2_L2_P, CSI2_L3_N, CSI2_L3_P
net class NET_SOM_MD_DSI0: DSI0_CK_N, DSI0_CK_P, DSI0_L0_N, DSI0_L0_P, DSI0_L1_N, DSI0_L1_P, DSI0_L2_N, DSI0_L2_P, DSI0_L3_N, DSI0_L3_P
net class NET_SOM_MD_PCIE0: CLKREQ_N_1V8, GPIO_0, GPIO_2, MD_PCIE0_2LANES.REFCLK_N, MD_PCIE0_2LANES.REFCLK_P, MD_PCIE0_2LANES.RX0_N, MD_PCIE0_2LANES.RX0_P, MD_PCIE0_2LANES.RX1_N, MD_PCIE0_2LANES.RX1_P, MD_PCIE0_2LANES.TX0_N, MD_PCIE0_2LANES.TX0_P, MD_PCIE0_2LANES.TX1_N, MD_PCIE0_2LANES.TX1_P
net class NET_SOM_MD_PCIE1: GPIO_21, GPIO_22, GPIO_23, MD_PCIE1_4LANES.REFCLK_N, MD_PCIE1_4LANES.REFCLK_P, MD_PCIE1_4LANES.RX0_N, MD_PCIE1_4LANES.RX0_P, MD_PCIE1_4LANES.RX1_N, MD_PCIE1_4LANES.RX1_P, MD_PCIE1_4LANES.RX2_N, MD_PCIE1_4LANES.RX2_P, MD_PCIE1_4LANES.RX3_N, MD_PCIE1_4LANES.RX3_P, MD_PCIE1_4LANES.TX0_N, MD_PCIE1_4LANES.TX0_P, MD_PCIE1_4LANES.TX1_N, MD_PCIE1_4LANES.TX1_P, MD_PCIE1_4LANES.TX2_N, MD_PCIE1_4LANES.TX2_P, MD_PCIE1_4LANES.TX3_N, MD_PCIE1_4LANES.TX3_P
net class NET_SOM_MD_GPIO; net class NET_SOM_MD_GPIO_LPASS: I2S_DATA0, I2S_DATA1, I2S_SCK, I2S_WS, MD_LPASS_GPIO_110, MD_LPASS_GPIO_111, MD_LPASS_GPIO_112, MD_LPASS_GPIO_113, MD_LPASS_GPIO_115, MD_LPASS_GPIO_120, MD_LPASS_GPIO_121, MD_LPASS_GPIO_122, MD_LPASS_GPIO_123, MD_LPASS_GPIO_125, MD_LPASS_GPIO_126, MD_LPASS_GPIO_127, MD_LPASS_GPIO_129, MD_LPASS_GPIO_130, MD_LPASS_GPIO_131, MD_LPASS_GPIO_132, NetMODULE1_B31, NetMODULE1_D32, NetMODULE1_E29
net class NET_SOM_MD_BOOT: GPIO_7, GPIO_8, GPIO_53, GPIO_66, GPIO_76, GPIO_91, GPIO_97, GPIO_98, GPIO_102

### Notes on the sheet
- Title:
- ID:
- Date:
- Time:
- Version:
- Sheet
- of
- RevAuthor:
- Reference Designs ARE PROVIDED "AS IS" AND "WITH ALL FAULTS. Arduino SA DISCLAIMS ALL OTHER WARRANTIES, EXPRESS OR IMPLIED, REGARDING PRODUCTS, INCLUDING BUT NOT LIMITED TO, ANY IMPLIED WARRANTIES OF MERCHANTABILITY OR FITNESS FOR A PARTICULAR PURPOSE.
  Arduino SA may make changes to specifications and product descriptions at any time, without notice. The Customer must not rely on the absence or characteristics of any features or instructions marked "reserved" or "undefined".
  Arduino SA reserves these for future definition and shall have no responsibility whatsoever for conflicts or incompatibilities arising from future changes to them. The product information on the Web Site or Materials is subject to change without notice.
  Do not finalize a design with this info. ARDUINO and other Arduino brands and logos and Trademarks of Arduino SA. All Arduino SA Trademarks cannot be used without owner's formal permission.
- File:
- Author:
- (in symbol M0029-A.19, part V) LPASS AUDIO ONLY

### Library data of the parts
MODULE1 = M0029-A.19: as MODULE1 on sheet MODULE_SAIL; Part Number: MODULE BGA; Pin Count: 1883

## Sheet MODULE_SAIL_FLASH.SchDoc: MODULE SAIL FLASH
size A3; Author: Silvio Navaretti; CompanyName: ARDUINO; DrawnBy: Silvio Navaretti; Engineer: Silvio Navaretti; Organization: ARDUINO; SheetNumber: 6; SheetTotal: 51; RevAuthor: Silvio Navaretti
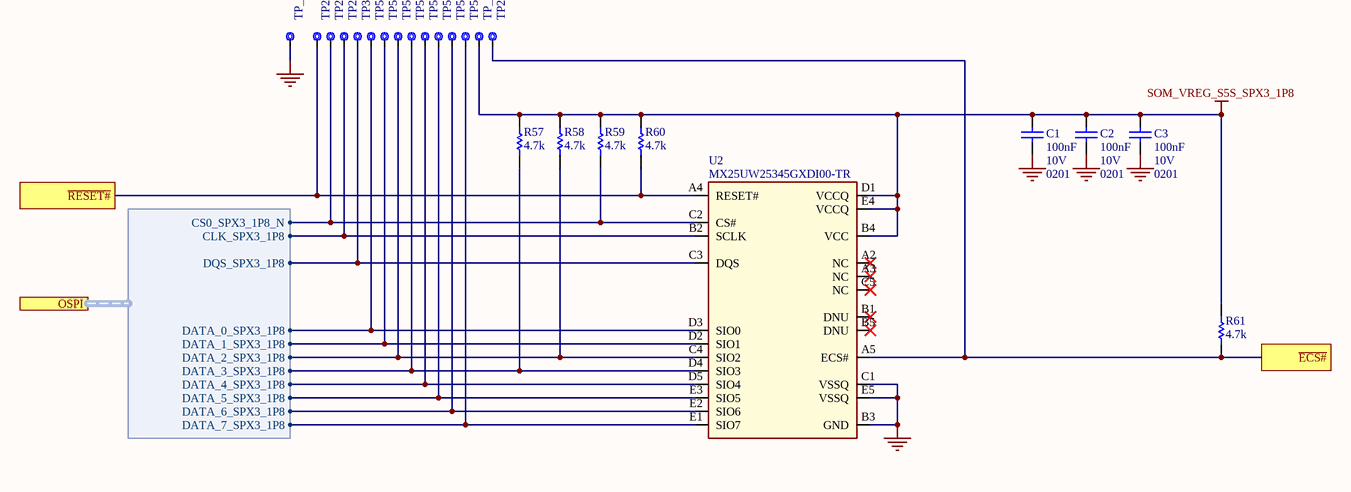
[diagram p7: MODULE_SAIL_FLASH.SchDoc]

### Parts
C1  value 100nF  Voltage: 10V  Case Code (Imperial): 0201  [CAP-0201]  (hidden comment: CL03A104KP3NNNC)
C2  value 100nF  Voltage: 10V  Case Code (Imperial): 0201  [CAP-0201]  (hidden comment: CL03A104KP3NNNC)
C3  value 100nF  Voltage: 10V  Case Code (Imperial): 0201  [CAP-0201]  (hidden comment: CL03A104KP3NNNC)
R57  value 4.7k  [RES-0201]  (hidden comment: RC0201FR-074K7L)
R58  value 4.7k  [RES-0201]  (hidden comment: RC0201FR-074K7L)
R59  value 4.7k  [RES-0201]  (hidden comment: RC0201FR-074K7L)
R60  value 4.7k  [RES-0201]  (hidden comment: RC0201FR-074K7L)
R61  value 4.7k  [RES-0201]  (hidden comment: RC0201FR-074K7L)
TP25  Test point 1.00mm  [TP-1.00MM]  (value not drawn)  (no BOM)
TP26  Test point 1.00mm  [TP-1.00MM]  (value not drawn)  (no BOM)
TP27  Test point 1.00mm  [TP-1.00MM]  (value not drawn)  (no BOM)
TP28  Test point 1.00mm  [TP-1.00MM]  (value not drawn)  (no BOM)
TP31  Test point 1.00mm  [TP-1.00MM]  (value not drawn)  (no BOM)
TP50  Test point 1.00mm  [TP-1.00MM]  (value not drawn)  (no BOM)
TP51  Test point 1.00mm  [TP-1.00MM]  (value not drawn)  (no BOM)
TP52  Test point 1.00mm  [TP-1.00MM]  (value not drawn)  (no BOM)
TP53  Test point 1.00mm  [TP-1.00MM]  (value not drawn)  (no BOM)
TP54  Test point 1.00mm  [TP-1.00MM]  (value not drawn)  (no BOM)
TP55  Test point 1.00mm  [TP-1.00MM]  (value not drawn)  (no BOM)
TP56  Test point 1.00mm  [TP-1.00MM]  (value not drawn)  (no BOM)
TP57  Test point 1.00mm  [TP-1.00MM]  (value not drawn)  (no BOM)
TP_FLASH_SAIL_1V8  Test point 1.00mm  [TP-1.00MM]  (value not drawn)  (no BOM)
TP_FLASH_SAIL_GND  Test point 1.00mm  [TP-1.00MM]  (value not drawn)  (no BOM)
U2  MX25UW25345GXDI00-TR  [MX25UW25345GXDI00-TR]

### Ports
OSPI (harness SOM_SAIL_QSPI0), ~{ECS#}, ~{RESET#}

### Harnesses
SOM_SAIL_QSPI0: DATA_0_SPX3_1P8, DATA_1_SPX3_1P8, DATA_2_SPX3_1P8, DATA_3_SPX3_1P8, DATA_4_SPX3_1P8, DATA_5_SPX3_1P8, DATA_6_SPX3_1P8, DATA_7_SPX3_1P8, CS0_SPX3_1P8_N, CLK_SPX3_1P8, DQS_SPX3_1P8

### Nets
GND: C1.1 C2.1 C3.1 TP_FLASH_SAIL_GND.X U2.B3(GND) U2.C1(VSSQ) U2.E5(VSSQ)
SOM_VREG_S5S_SPX3_1P8: C1.2 C2.2 C3.2 R57.2 R58.2 R59.2 R60.2 R61.2 TP_FLASH_SAIL_1V8.X U2.B4(VCC) U2.D1(VCCQ) U2.E4(VCCQ)
NetMODULE1_BA29: R59.1 TP27.X U2.C2(CS#) ; port OSPI.CS0_SPX3_1P8_N
NetMODULE1_BB28: TP54.X U2.D5(SIO4) ; port OSPI.DATA_4_SPX3_1P8
NetMODULE1_BB29: R58.1 TP52.X U2.C4(SIO2) ; port OSPI.DATA_2_SPX3_1P8
NetMODULE1_BC28: TP31.X U2.C3(DQS) ; port OSPI.DQS_SPX3_1P8
NetMODULE1_BC29: TP28.X U2.B2(SCLK) ; port OSPI.CLK_SPX3_1P8
NetMODULE1_BD28: TP55.X U2.E3(SIO5) ; port OSPI.DATA_5_SPX3_1P8
NetMODULE1_BD29: R57.1 TP53.X U2.D4(SIO3) ; port OSPI.DATA_3_SPX3_1P8
NetMODULE1_BD41: R60.1 TP26.X U2.A4(RESET#) ; port ~{RESET#}
NetMODULE1_BE28: TP56.X U2.E2(SIO6) ; port OSPI.DATA_6_SPX3_1P8
NetMODULE1_BE29: TP50.X U2.D3(SIO0) ; port OSPI.DATA_0_SPX3_1P8
NetMODULE1_BF28: TP51.X U2.D2(SIO1) ; port OSPI.DATA_1_SPX3_1P8
NetMODULE1_BF29: TP57.X U2.E1(SIO7) ; port OSPI.DATA_7_SPX3_1P8
NetR61_1: R61.1 TP25.X U2.A5(ECS#) ; port ~{ECS#}

Not connected (* = marked no-connect by the designer): U2 A2(NC)* A3(NC)* B1(DNU)* B5(DNU)* C5(NC)*

### Notes on the sheet
- Title:
- ID:
- Date:
- Time:
- Version:
- Sheet
- of
- RevAuthor:
- Reference Designs ARE PROVIDED "AS IS" AND "WITH ALL FAULTS. Arduino SA DISCLAIMS ALL OTHER WARRANTIES, EXPRESS OR IMPLIED, REGARDING PRODUCTS, INCLUDING BUT NOT LIMITED TO, ANY IMPLIED WARRANTIES OF MERCHANTABILITY OR FITNESS FOR A PARTICULAR PURPOSE.
  Arduino SA may make changes to specifications and product descriptions at any time, without notice. The Customer must not rely on the absence or characteristics of any features or instructions marked "reserved" or "undefined".
  Arduino SA reserves these for future definition and shall have no responsibility whatsoever for conflicts or incompatibilities arising from future changes to them. The product information on the Web Site or Materials is subject to change without notice.
  Do not finalize a design with this info. ARDUINO and other Arduino brands and logos and Trademarks of Arduino SA. All Arduino SA Trademarks cannot be used without owner's formal permission.
- File:
- Author:

### Library data of the parts
C1-C3 = C0113-A.6: CAP CHIP 0201 100nF 10% 10V X5R; Manufacturer: Samsung Electro-Mechanics; Code Arduino: C0113; Technology: Ceramic; Part Number: CL03A104KP3NNNC; Dielectric: X5R; Tolerance: 10%
R57-R61 = R0151-A.21: RES CHIP 0201 4k7 1% 1/20W; Manufacturer: Yageo; Temperature coefficient: 200ppm; Power: 50mW; Code Arduino: A5521; Technology: Thick film; Case Code (Imperial): 0201; Part Number: RC0201FR-074K7L; Tolerance: 1%
TP25-TP28 TP31 TP50-TP57 TP_FLASH_SAIL_1V8 TP_FLASH_SAIL_GND = UT0013-A.6: Part Number: This is not a component; Design Item ID: CMP-018-0005-A.3; Source: ut.SchLib; Manufacturer: This is not a component; Code Arduino: This is not a component; Pin Count: 1
U2 = U0506-A.2: IC NOR FLASH, VDD 1.8V, OSPI, 256Mb x1/x8, BGA24 6x8mm; Manufacturer: Macronix; Code Arduino: U0506; Part Number: MX25UW25345GXDI00-TR

## Sheet MODULE_STRAPS_MD.SchDoc: MODULE STRAPS MD
size A3; Author: Silvio Navaretti; CompanyName: ARDUINO; DrawnBy: Silvio Navaretti; Engineer: Silvio Navaretti; Organization: ARDUINO; SheetNumber: 7; SheetTotal: 51; RevAuthor: Silvio Navaretti
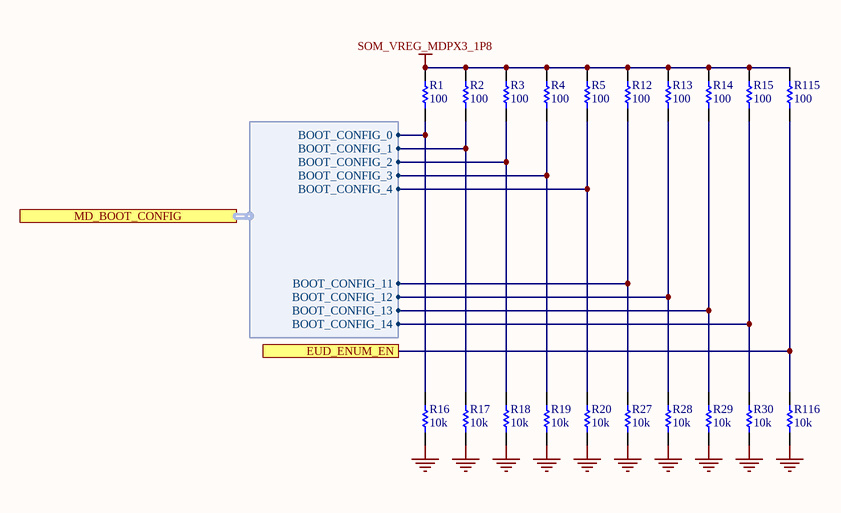
[diagram p8: MODULE_STRAPS_MD.SchDoc]

### Parts
R1  value 100  [RES-0201]  (hidden comment: RC0201FR-07100RL)
R2  value 100  [RES-0201]  (hidden comment: RC0201FR-07100RL)
R3  value 100  [RES-0201]  (hidden comment: RC0201FR-07100RL)
R4  value 100  [RES-0201]  (hidden comment: RC0201FR-07100RL)
R5  value 100  [RES-0201]  (hidden comment: RC0201FR-07100RL)
R12  value 100  [RES-0201]  (hidden comment: RC0201FR-07100RL)
R13  value 100  [RES-0201]  (hidden comment: RC0201FR-07100RL)
R14  value 100  [RES-0201]  (hidden comment: RC0201FR-07100RL)
R15  value 100  [RES-0201]  (hidden comment: RC0201FR-07100RL)
R16  value 10k  [RES-0201]  (hidden comment: RC0201FR-0710KL)
R17  value 10k  [RES-0201]  (hidden comment: RC0201FR-0710KL)
R18  value 10k  [RES-0201]  (hidden comment: RC0201FR-0710KL)
R19  value 10k  [RES-0201]  (hidden comment: RC0201FR-0710KL)
R20  value 10k  [RES-0201]  (hidden comment: RC0201FR-0710KL)
R27  value 10k  [RES-0201]  (hidden comment: RC0201FR-0710KL)
R28  value 10k  [RES-0201]  (hidden comment: RC0201FR-0710KL)
R29  value 10k  [RES-0201]  (hidden comment: RC0201FR-0710KL)
R30  value 10k  [RES-0201]  (hidden comment: RC0201FR-0710KL)
R115  value 100  [RES-0201]  (hidden comment: RC0201FR-07100RL)
R116  value 10k  [RES-0201]  (hidden comment: RC0201FR-0710KL)

### Ports
EUD_ENUM_EN, MD_BOOT_CONFIG (harness SOM_MD_BOOT_CONFIG)

### Harnesses
SOM_MD_BOOT_CONFIG: BOOT_CONFIG_0, BOOT_CONFIG_1, BOOT_CONFIG_2, BOOT_CONFIG_3, BOOT_CONFIG_4, BOOT_CONFIG_11, BOOT_CONFIG_12, BOOT_CONFIG_13, BOOT_CONFIG_14

### Nets
GND: R16.1 R17.1 R18.1 R19.1 R20.1 R27.1 R28.1 R29.1 R30.1 R116.1
SOM_VREG_MDPX3_1P8: R1.1 R2.1 R3.1 R4.1 R5.1 R12.1 R13.1 R14.1 R15.1 R115.1
GPIO_7: R13.2 R28.2 ; port MD_BOOT_CONFIG.BOOT_CONFIG_12
GPIO_8: R15.2 R30.2 ; port MD_BOOT_CONFIG.BOOT_CONFIG_14
GPIO_53: R12.2 R27.2 ; port MD_BOOT_CONFIG.BOOT_CONFIG_11
GPIO_66: R14.2 R29.2 ; port MD_BOOT_CONFIG.BOOT_CONFIG_13
GPIO_76: R2.2 R17.2 ; port MD_BOOT_CONFIG.BOOT_CONFIG_1
GPIO_91: R1.2 R16.2 ; port MD_BOOT_CONFIG.BOOT_CONFIG_0
GPIO_97: R3.2 R18.2 ; port MD_BOOT_CONFIG.BOOT_CONFIG_2
GPIO_98: R4.2 R19.2 ; port MD_BOOT_CONFIG.BOOT_CONFIG_3
GPIO_102: R5.2 R20.2 ; port MD_BOOT_CONFIG.BOOT_CONFIG_4
MD_GPIO_99: R115.2 R116.2 ; port EUD_ENUM_EN

### Notes on the sheet
- Title:
- ID:
- Date:
- Time:
- Version:
- Sheet
- of
- RevAuthor:
- Reference Designs ARE PROVIDED "AS IS" AND "WITH ALL FAULTS. Arduino SA DISCLAIMS ALL OTHER WARRANTIES, EXPRESS OR IMPLIED, REGARDING PRODUCTS, INCLUDING BUT NOT LIMITED TO, ANY IMPLIED WARRANTIES OF MERCHANTABILITY OR FITNESS FOR A PARTICULAR PURPOSE.
  Arduino SA may make changes to specifications and product descriptions at any time, without notice. The Customer must not rely on the absence or characteristics of any features or instructions marked "reserved" or "undefined".
  Arduino SA reserves these for future definition and shall have no responsibility whatsoever for conflicts or incompatibilities arising from future changes to them. The product information on the Web Site or Materials is subject to change without notice.
  Do not finalize a design with this info. ARDUINO and other Arduino brands and logos and Trademarks of Arduino SA. All Arduino SA Trademarks cannot be used without owner's formal permission.
- File:
- Author:

### Library data of the parts
R1-R5 R12-R15 R115 = R0235-A.13: RES CHIP 0201 100R 1% 1/20W; Manufacturer: YAGEO; Power: 50mW; Temperature coefficient: 200ppm; Code Arduino: R0235; Tolerance: 1%; Case Code (Imperial): 0201; Technology: Thick film; Part Number: RC0201FR-07100RL
R16-R20 R27-R30 R116 = R0145-A.21: RES CHIP 0201 10k 1% 1/20W; Manufacturer: Yageo; Power: 50mW; Temperature coefficient: 200ppm; Code Arduino: R0145; Manufacturer 2: Samsung Electro-Mechanics; Tolerance: 1%; Case Code (Imperial): 0201; Part Number: RC0201FR-0710KL; Technology: Thick film

## Sheet MODULE_STRAPS_SAIL.SchDoc: MODULE STRAPS SAIL
size A3; Author: Silvio Navaretti; CompanyName: ARDUINO; DrawnBy: Silvio Navaretti; Engineer: Silvio Navaretti; Organization: ARDUINO; SheetNumber: 8; SheetTotal: 51; RevAuthor: Silvio Navaretti
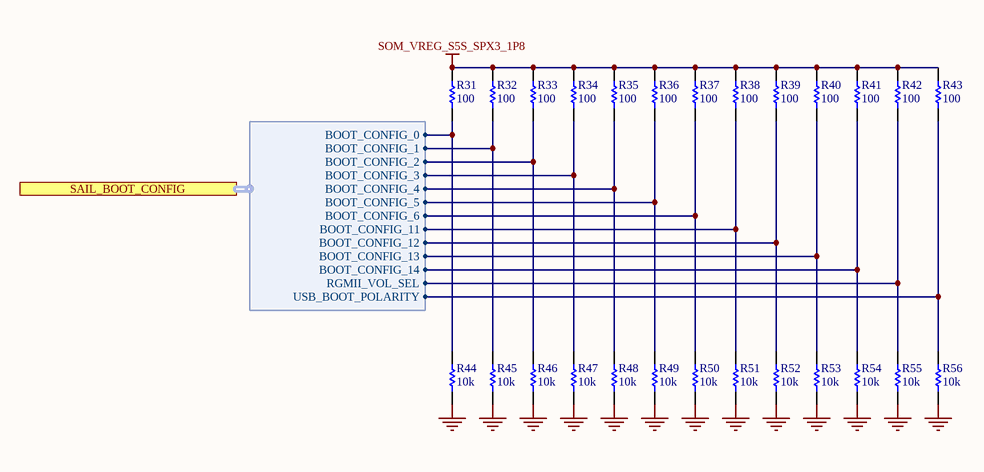
[diagram p9: MODULE_STRAPS_SAIL.SchDoc]

### Parts
R31  value 100  [RES-0201]  (hidden comment: RC0201FR-07100RL)
R32  value 100  [RES-0201]  (hidden comment: RC0201FR-07100RL)
R33  value 100  [RES-0201]  (hidden comment: RC0201FR-07100RL)
R34  value 100  [RES-0201]  (hidden comment: RC0201FR-07100RL)
R35  value 100  [RES-0201]  (hidden comment: RC0201FR-07100RL)
R36  value 100  [RES-0201]  (hidden comment: RC0201FR-07100RL)
R37  value 100  [RES-0201]  (hidden comment: RC0201FR-07100RL)
R38  value 100  [RES-0201]  (hidden comment: RC0201FR-07100RL)
R39  value 100  [RES-0201]  (hidden comment: RC0201FR-07100RL)
R40  value 100  [RES-0201]  (hidden comment: RC0201FR-07100RL)
R41  value 100  [RES-0201]  (hidden comment: RC0201FR-07100RL)
R42  value 100  [RES-0201]  (hidden comment: RC0201FR-07100RL)
R43  value 100  [RES-0201]  (hidden comment: RC0201FR-07100RL)
R44  value 10k  [RES-0201]  (hidden comment: RC0201FR-0710KL)
R45  value 10k  [RES-0201]  (hidden comment: RC0201FR-0710KL)
R46  value 10k  [RES-0201]  (hidden comment: RC0201FR-0710KL)
R47  value 10k  [RES-0201]  (hidden comment: RC0201FR-0710KL)
R48  value 10k  [RES-0201]  (hidden comment: RC0201FR-0710KL)
R49  value 10k  [RES-0201]  (hidden comment: RC0201FR-0710KL)
R50  value 10k  [RES-0201]  (hidden comment: RC0201FR-0710KL)
R51  value 10k  [RES-0201]  (hidden comment: RC0201FR-0710KL)
R52  value 10k  [RES-0201]  (hidden comment: RC0201FR-0710KL)
R53  value 10k  [RES-0201]  (hidden comment: RC0201FR-0710KL)
R54  value 10k  [RES-0201]  (hidden comment: RC0201FR-0710KL)
R55  value 10k  [RES-0201]  (hidden comment: RC0201FR-0710KL)
R56  value 10k  [RES-0201]  (hidden comment: RC0201FR-0710KL)

### Ports
SAIL_BOOT_CONFIG (harness SOM_SAIL_BOOT_CONFIG)

### Harnesses
SOM_SAIL_BOOT_CONFIG: BOOT_CONFIG_0, BOOT_CONFIG_1, BOOT_CONFIG_2, BOOT_CONFIG_3, BOOT_CONFIG_4, BOOT_CONFIG_5, BOOT_CONFIG_6, BOOT_CONFIG_11, BOOT_CONFIG_12, BOOT_CONFIG_13, BOOT_CONFIG_14, RGMII_VOL_SEL, USB_BOOT_POLARITY

### Nets
GND: R44.1 R45.1 R46.1 R47.1 R48.1 R49.1 R50.1 R51.1 R52.1 R53.1 R54.1 R55.1 R56.1
SOM_VREG_S5S_SPX3_1P8: R31.1 R32.1 R33.1 R34.1 R35.1 R36.1 R37.1 R38.1 R39.1 R40.1 R41.1 R42.1 R43.1
RTSS_IO_4: R43.2 R56.2 ; port SAIL_BOOT_CONFIG.USB_BOOT_POLARITY
RTSS_IO_6: R40.2 R53.2 ; port SAIL_BOOT_CONFIG.BOOT_CONFIG_13
RTSS_IO_7: R41.2 R54.2 ; port SAIL_BOOT_CONFIG.BOOT_CONFIG_14
RTSS_IO_10: R32.2 R45.2 ; port SAIL_BOOT_CONFIG.BOOT_CONFIG_1
RTSS_IO_11: R33.2 R46.2 ; port SAIL_BOOT_CONFIG.BOOT_CONFIG_2
RTSS_IO_12: R34.2 R47.2 ; port SAIL_BOOT_CONFIG.BOOT_CONFIG_3
RTSS_IO_14: R35.2 R48.2 ; port SAIL_BOOT_CONFIG.BOOT_CONFIG_4
RTSS_IO_15: R36.2 R49.2 ; port SAIL_BOOT_CONFIG.BOOT_CONFIG_5
RTSS_IO_16: R38.2 R51.2 ; port SAIL_BOOT_CONFIG.BOOT_CONFIG_11
RTSS_IO_17: R39.2 R52.2 ; port SAIL_BOOT_CONFIG.BOOT_CONFIG_12
RTSS_IO_18: R37.2 R50.2 ; port SAIL_BOOT_CONFIG.BOOT_CONFIG_6
RTSS_IO_21: R42.2 R55.2 ; port SAIL_BOOT_CONFIG.RGMII_VOL_SEL
RTSS_IO_51: R31.2 R44.2 ; port SAIL_BOOT_CONFIG.BOOT_CONFIG_0

### Notes on the sheet
- Title:
- ID:
- Date:
- Time:
- Version:
- Sheet
- of
- RevAuthor:
- Reference Designs ARE PROVIDED "AS IS" AND "WITH ALL FAULTS. Arduino SA DISCLAIMS ALL OTHER WARRANTIES, EXPRESS OR IMPLIED, REGARDING PRODUCTS, INCLUDING BUT NOT LIMITED TO, ANY IMPLIED WARRANTIES OF MERCHANTABILITY OR FITNESS FOR A PARTICULAR PURPOSE.
  Arduino SA may make changes to specifications and product descriptions at any time, without notice. The Customer must not rely on the absence or characteristics of any features or instructions marked "reserved" or "undefined".
  Arduino SA reserves these for future definition and shall have no responsibility whatsoever for conflicts or incompatibilities arising from future changes to them. The product information on the Web Site or Materials is subject to change without notice.
  Do not finalize a design with this info. ARDUINO and other Arduino brands and logos and Trademarks of Arduino SA. All Arduino SA Trademarks cannot be used without owner's formal permission.
- File:
- Author:

### Library data of the parts
R31-R43 = R0235-A.13: as R1 on sheet MODULE_STRAPS_MD; Tolerance: 1%; Case Code (Imperial): 0201; Technology: Thick film; Part Number: RC0201FR-07100RL
R44-R56 = R0145-A.21: as R16-R20 on sheet MODULE_STRAPS_MD; Manufacturer 2: Samsung Electro-Mechanics; Tolerance: 1%; Case Code (Imperial): 0201; Part Number: RC0201FR-0710KL; Technology: Thick film